# Altium project Gateway.PrjPcb
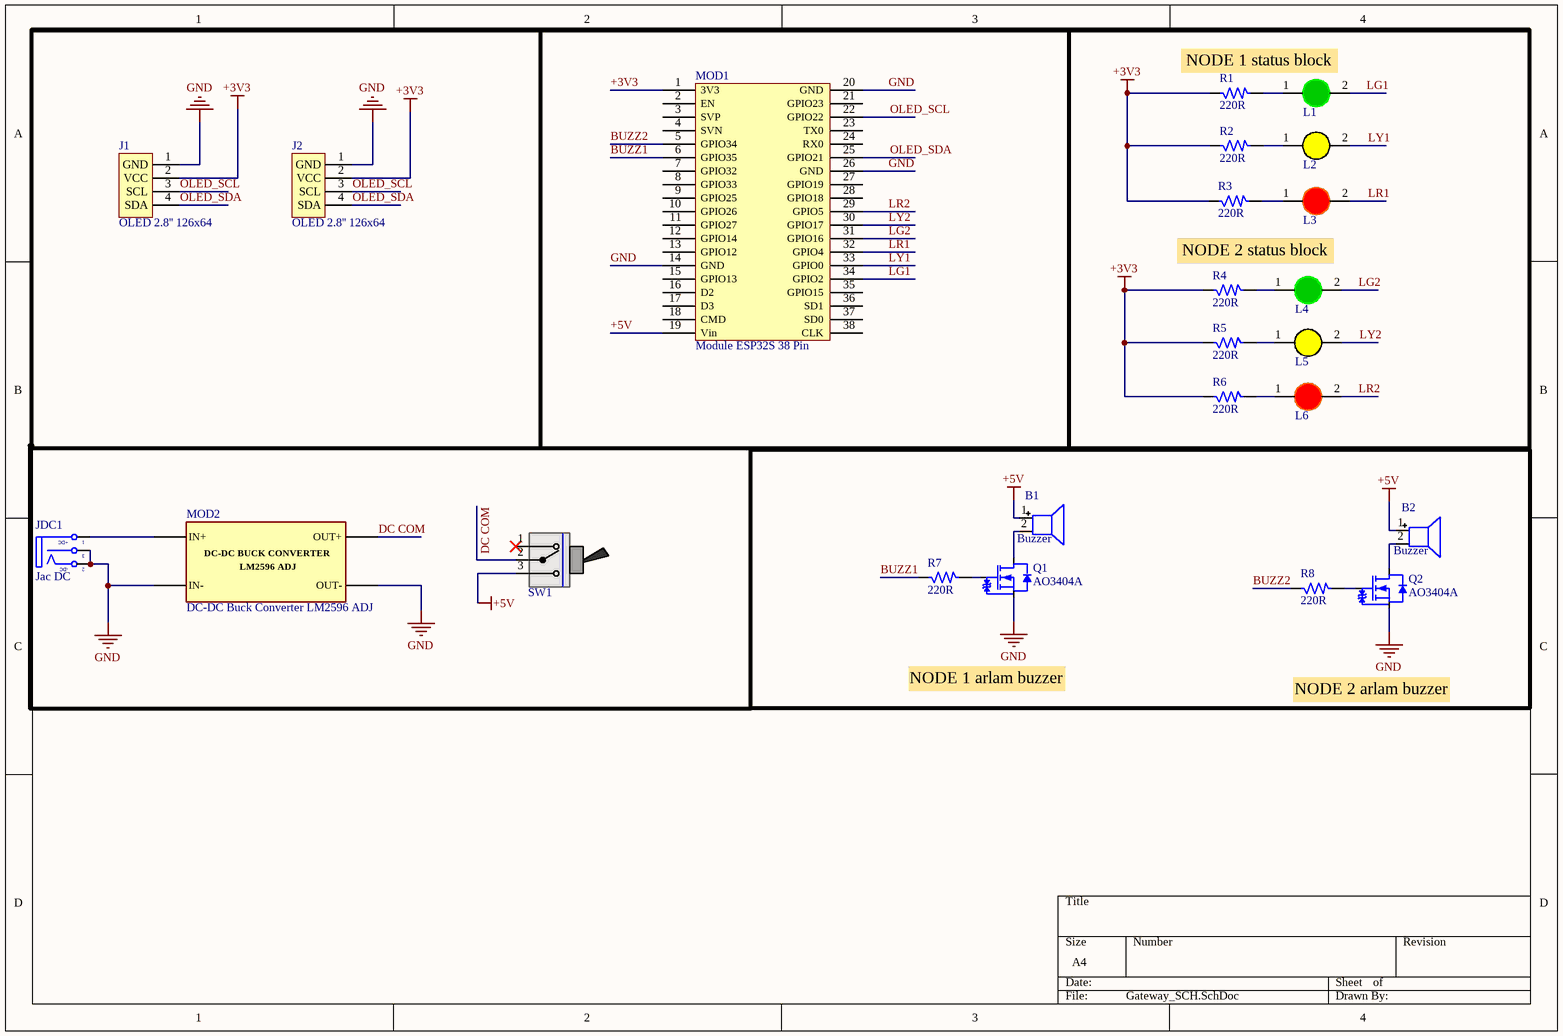
[diagram p0: Gateway_SCH.SchDoc]
1 sheet, 24 parts. Net scope: global (net labels, ports and power ports of the same name join across sheets).
Board file: Gateway_PCB.PcbDoc

## Sheet Gateway_SCH.SchDoc
size A4; SheetNumber: 1; SheetTotal: 1

### Parts
B1  Buzzer  [Coi Chip]
B2  Buzzer  [Coi Chip]
J1  OLED 2.8'' 126x64  [OLED 0.96'' 128x64]
J2  OLED 2.8'' 126x64  [OLED 0.96'' 128x64]
JDC1  Jac DC  [DC-IN]
L1  LED 5mm  [LED-5MM-Green]  (value not drawn)
L2  LED 5mm  [LED-5MM-Yellow]  (value not drawn)
L3  LED 5mm  [LED-5MM-RED]  (value not drawn)
L4  LED 5mm  [LED-5MM-Green]  (value not drawn)
L5  LED 5mm  [LED-5MM-Yellow]  (value not drawn)
L6  LED 5mm  [LED-5MM-RED]  (value not drawn)
MOD1  Module ESP32S 38 Pin  [ESP32S MODULE 38 PIN]
MOD2  DC-DC Buck Converter LM2596 ADJ  [Module DC-DC Buck Converter LM2596]
Q1  AO3404A  [SOT 23-3]
Q2  AO3404A  [SOT 23-3]
R1  220R  [R_0805_H0.43]
R2  220R  [R_0805_H0.43]
R3  220R  [R_0805_H0.43]
R4  220R  [R_0805_H0.43]
R5  220R  [R_0805_H0.43]
R6  220R  [R_0805_H0.43]
R7  220R  [R_0805_H0.43]
R8  220R  [R_0805_H0.43]
SW1  SW_Toggle_MST-103  [TOGGLE SWITCH MTS-103]  (value not drawn)

### Nets
+3V3: J1.2(VCC) J2.2(VCC) MOD1.1(3V3) R1.1 R2.1 R3.1 R4.1 R5.1 R6.1
+5V: B1.1(+) B2.1(+) MOD1.19(Vin) SW1.3
GND: J1.1(GND) J2.1(GND) JDC1.2(TN) JDC1.3(S) MOD1.14(GND) MOD1.20(GND) MOD1.26(GND) MOD2.2(IN-) MOD2.4(OUT-) Q1.2(S) Q2.2(S)
BUZZ1: MOD1.6(GPIO35) R7.1
BUZZ2: MOD1.5(GPIO34) R8.1
DC COM: MOD2.3(OUT+) SW1.2
LG1: L1.2(K) MOD1.34(GPIO2)
LG2: L4.2(K) MOD1.31(GPIO16)
LR1: L3.2(K) MOD1.32(GPIO4)
LR2: L6.2(K) MOD1.29(GPIO5)
LY1: L2.2(K) MOD1.33(GPIO0)
LY2: L5.2(K) MOD1.30(GPIO17)
OLED_SCL: J1.3(SCL) J2.3(SCL) MOD1.22(GPIO22)
OLED_SDA: J1.4(SDA) J2.4(SDA) MOD1.25(GPIO21)
NetB1_2: B1.2 Q1.3(D)
NetB2_2: B2.2 Q2.3(D)
NetJDC1_1: JDC1.1(T) MOD2.1(IN+)
NetL1_1: L1.1(A) R1.2
NetL2_1: L2.1(A) R2.2
NetL3_1: L3.1(A) R3.2
NetL4_1: L4.1(A) R4.2
NetL5_1: L5.1(A) R5.2
NetL6_1: L6.1(A) R6.2
NetQ1_1: Q1.1(G) R7.2
NetQ2_1: Q2.1(G) R8.2

Not connected (* = marked no-connect by the designer): MOD1 2(EN) 3(SVP) 4(SVN) 7(GPIO32) 8(GPIO33) 9(GPIO25) 10(GPIO26) 11(GPIO27) 12(GPIO14) 13(GPIO12) 15(GPIO13) 16(D2) 17(D3) 18(CMD) 21(GPIO23) 23(TX0) 24(RX0) 27(GPIO19) 28(GPIO18) 35(GPIO15) 36(SD1) 37(SD0) 38(CLK); SW1 1*

### Notes on the sheet
- NODE 1 status block
- NODE 2 status block
- NODE 1 arlam buzzer
- NODE 2 arlam buzzer
- (in symbol DCIN) +DC; -DC
- (in symbol MOD-DC-DC_Buck_LM2596_3A) DC-DC BUCK CONVERTER; LM2596 ADJ

### Library data of the parts
B1 B2 = Buzzer: 9.5x12mm, 7.62 pitch
J1 J2 = OLED 2.8'' 126x64: Manufacturer: Molex; Alternate Part Number-1: NA; Manufacturer Part Number: 22-10-2061; Case/Package: TH-CON; Supplier-1: SP ROAD; Supplier Part Number-1: NA
JDC1 = DCIN: Jac DC input; Value: Jac DC
L1 L4 = LED 5mm Xanh La: Cắm; Don_Vi: Con; Ma_Hang: MH008969; Ten_Linh_Kien: LED 5MM Phủ Xanh (1000c); Ghi_Chu: *; Kieu_Chan: *; Chung_Loai: Cắm
L2 L5 = LED 5mm Vang: Cắm; Don_Vi: Con; Ma_Hang: MH008968; Ten_Linh_Kien: Led 5MM Phủ Vàng (1000c); Ghi_Chu: *; Kieu_Chan: *; Chung_Loai: Cắm
L3 L6 = LED 5mm Do: Cắm; Don_Vi: Con; Ma_Hang: MH008967; Ten_Linh_Kien: Led 5MM Phủ Đỏ (1000c); Ghi_Chu: *; Kieu_Chan: *; Chung_Loai: Cắm
MOD1 = MOD_ESP32S_38P
MOD2 = MOD-DC-DC_Buck_LM2596_3A: Input: 3-30V, Output:1.5-30V. I_out = 3A (max). Dimensions: 45x20x14mm
Q1 Q2 = MOSFET-N_30V-5.8A-SOT23: N-Channel 30V 5.8A (Ta) 1.4W (Ta) Surface Mount SOT-23-3L; Manufacturer: International Rectifier; Alternate Part Number-1: PMV50ENEAR; Manufacturer Part Number: AO3404A; Case/Package: SOT23; Supplier-1: ARROW; Supplier Part Number-1: AO3404A
R1-R8 = Res: Resistor; Value: R1/4W - 1K
SW1 = SW_Toggle_MST-103: SWITCH TOGGLE; MANF_PART#: MHSS1105; MANF: Apem; VALUE: SlideSwitch; DESC: DESCRIPTION; ASSEMBLY: ASSEMBLY; PARAM: PARAM; PRICE: 0.5$